# EAGLE design M502-3 (EAGLE 4.11)
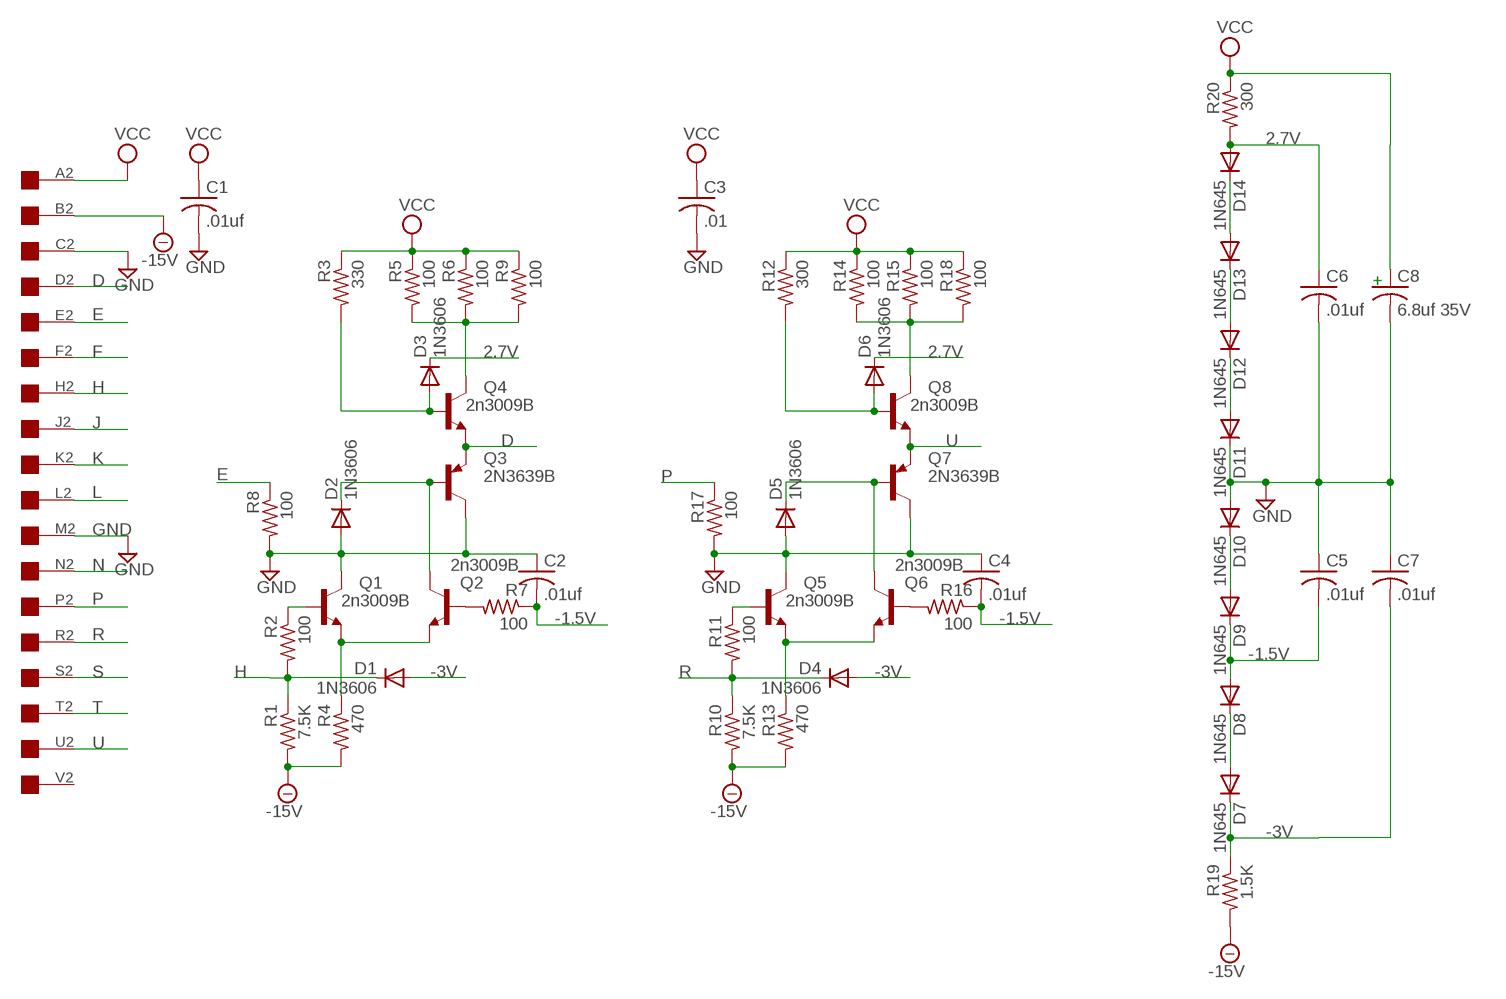
[diagram p0: schematic, sheet 1]

## Parts
A  ONE-SIDED  [ONE-SIDED]
C1  .01uf  C-US050-025X075  [C050-025X075]
C2  .01uf  C-US050-025X075  [C050-025X075]
C3  .01  C-US050-025X075  [C050-025X075]
C4  .01uf  C-US050-025X075  [C050-025X075]
C5  .01uf  C-US050-025X075  [C050-025X075]
C6  .01uf  C-US050-025X075  [C050-025X075]
C7  .01uf  C-US050-025X075  [C050-025X075]
C8  6.8uf 35V  C-US102-043X133  [C102-043X133]
D1  1N3606  1N4004  [DO41-10]
D2  1N3606  1N4004  [DO41-10]
D3  1N3606  1N4004  [DO41-10]
D4  1N3606  1N4004  [DO41-10]
D5  1N3606  1N4004  [DO41-10]
D6  1N3606  1N4004  [DO41-10]
D7  1N645  1N4004  [DO41-10]
D8  1N645  1N4004  [DO41-10]
D9  1N645  1N4004  [DO41-10]
D10  1N645  1N4004  [DO41-10]
D11  1N645  1N4004  [DO41-10]
D12  1N645  1N4004  [DO41-10]
D13  1N645  1N4004  [DO41-10]
D14  1N645  1N4004  [DO41-10]
Q1  2n3009B  2N1711  [TO39]
Q2  2n3009B  2N1711  [TO39]
Q3  2N3639B  2N5415  [TO39]
Q4  2n3009B  2N1711  [TO39]
Q5  2n3009B  2N1711  [TO39]
Q6  2n3009B  2N1711  [TO39]
Q7  2N3639B  2N5415  [TO39]
Q8  2n3009B  2N1711  [TO39]
R1  7.5K  R-US_0207/10  [0207/10]
R2  100  R-US_0207/10  [0207/10]
R3  330  R-US_0207/10  [0207/10]
R4  470  R-US_0207/10  [0207/10]
R5  100  R-US_0207/10  [0207/10]
R6  100  R-US_0207/10  [0207/10]
R7  100  R-US_0207/10  [0207/10]
R8  100  R-US_0207/10  [0207/10]
R9  100  R-US_0207/10  [0207/10]
R10  7.5K  R-US_0207/10  [0207/10]
R11  100  R-US_0207/10  [0207/10]
R12  300  R-US_0207/10  [0207/10]
R13  470  R-US_0207/10  [0207/10]
R14  100  R-US_0207/10  [0207/10]
R15  100  R-US_0207/10  [0207/10]
R16  100  R-US_0207/10  [0207/10]
R17  100  R-US_0207/10  [0207/10]
R18  100  R-US_0207/10  [0207/10]
R19  1.5K  R-US_0207/10  [0207/10]
R20  300  R-US_0207/10  [0207/10]

## Nets
2.7V: C6.1 D3.C D6.C D14.A R20.2
-1.5V: C2.2 C4.2 C5.2 D8.A D9.C R7.1 R16.1
-3V: C7.2 D1.A D4.A D7.C R19.1
-15V: A.B2 R1.2 R4.2 R10.2 R13.2 R19.2
D: A.D2 Q3.1(E) Q4.1(E)
E: A.E2 R8.1
F: A.F2
GND: A.C2 A.M2 C1.2 C2.1 C3.2 C4.1 C5.1 C6.2 C7.1 C8.2 D2.A D5.A D10.A D11.C Q1.3(C) Q3.3(C) Q5.3(C) Q7.3(C) R8.2 R17.2
H: A.H2 D1.C R1.1 R2.2
J: A.J2
K: A.K2
L: A.L2
N: A.N2
N$1: Q4.3(C) R5.2 R6.2 R9.2
N$2: Q1.2(B) R2.1
N$3: Q5.1(E) Q6.1(E) R13.1
N$4: Q1.1(E) Q2.1(E) R4.1
N$6: D11.A D12.C
N$7: D2.C Q2.3(C) Q3.2(B)
N$8: D3.A Q4.2(B) R3.2
N$9: D7.A D8.C
N$10: Q5.2(B) R11.1
N$11: D5.C Q6.3(C) Q7.2(B)
N$12: Q2.2(B) R7.2
N$13: D12.A D13.C
N$14: D9.A D10.C
N$15: Q8.3(C) R14.2 R15.2 R18.2
N$17: D13.A D14.C
N$18: D6.A Q8.2(B) R12.2
N$19: Q6.2(B) R16.2
P: A.P2 R17.1
R: A.R2 D4.C R10.1 R11.2
S: A.S2
T: A.T2
U: A.U2 Q7.1(E) Q8.1(E)
VCC: A.A2 C1.1 C3.1 C8.1 R3.1 R5.1 R6.1 R9.1 R12.1 R14.1 R15.1 R18.1 R20.1
Unconnected: A.V2

## Notes on the sheet
- +

## Library data of the parts
A = con-dec:ONE-SIDED: One-sided DEC Flip-Chip single card fingers
C1-C8 = rcl:C-US: CAPACITOR, American symbol
D1-D14 = diode:1N4004: DIODE general purpose rectifier, 1 A
Q1 Q2 Q4-Q6 Q8 = transistor-npn:2N1711: NPN Transistor
Q3 Q7 = transistor-pnp:2N5415*: PNP Transistror
R1-R20 = rcl:R-US_: RESISTOR, American symbol

## Board
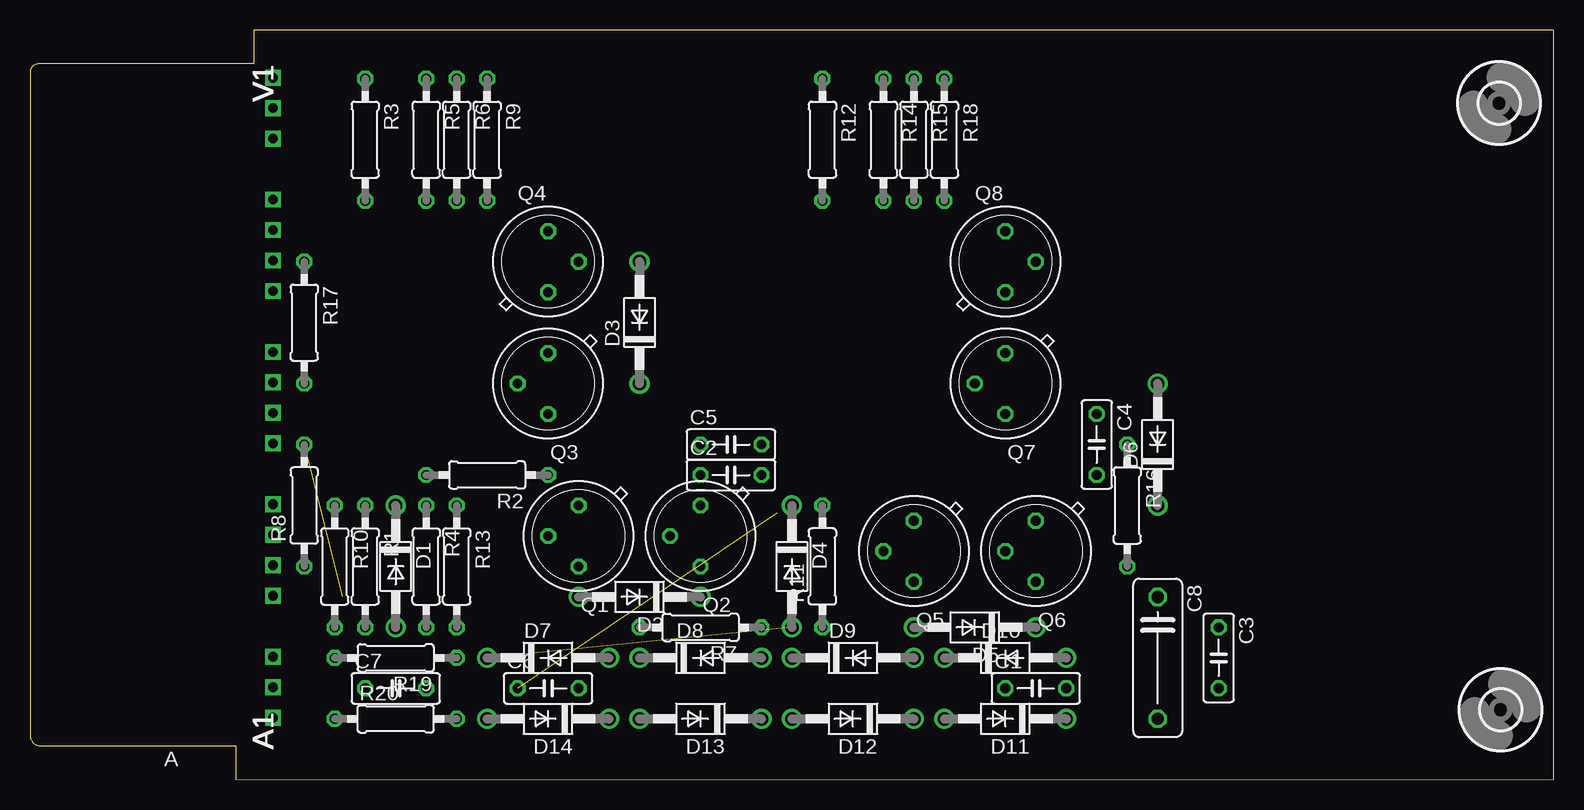
[diagram p1: board, top side]
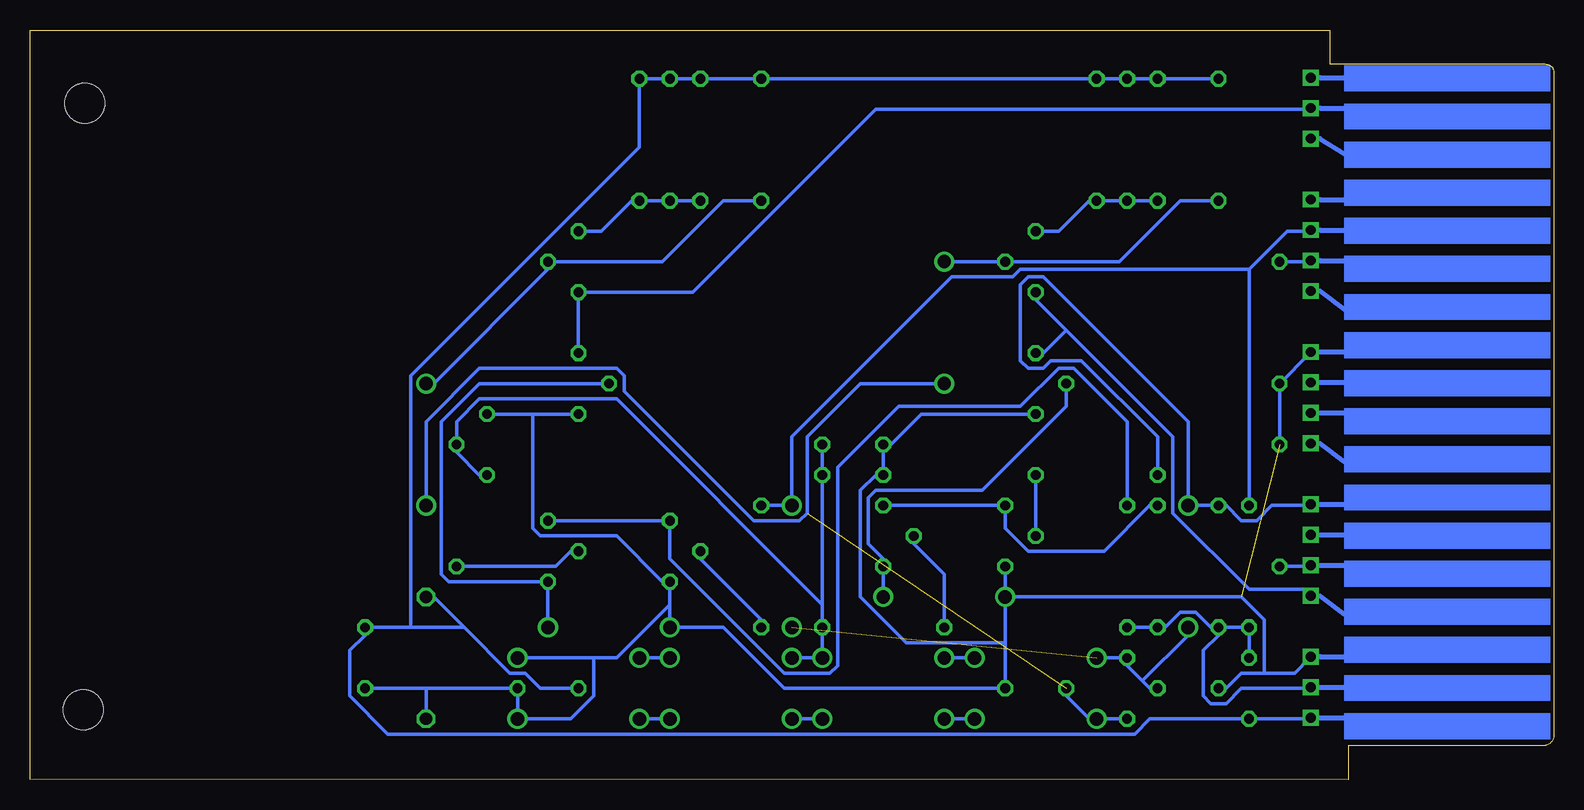
[diagram p2: board, bottom side, seen from below]

Size 126.98 x 62.48 mm. Coordinates in mm from the lower left corner, seen from the top.
Outline: 17.14,2.83 17.14,0 126.98,0.04 126.98,62.45 18.66,62.48 18.66,59.65 0.69,59.65 arc90 0,58.96 0,3.72 arc90 0.89,2.83 17.14,2.83
Copper layers (1*16): Top 0.035mm / dielectric 1.5mm / Bottom 0.035mm
Design rules "10mils": minimum track width 12mil, minimum drill 28mil, track to track 10mil, track to pad 10mil, pad to pad 10mil, via to via 10mil, smd to smd 10mil, copper to edge 40mil, drill to drill 10mil, minimum pad ring 10mil, minimum via ring 8mil, stop-mask expansion 0mil, vias tented up to drill 0mil, thermal gap 10mil

### Footprints (pad centres in the part's own frame; a part is rotated, then mirrored left to right if it is on the bottom)
ONE-SIDED = drill 0.813 square: A2 20.256,5.175; B2 20.256,7.715; C2 20.256,10.255; D2 20.256,15.335; E2 20.256,17.875; F2 20.256,20.415; H2 20.256,22.955; J2 20.256,28.035; K2 20.256,30.575; L2 20.256,33.115; M2 20.256,35.655; N2 20.256,40.735; P2 20.256,43.275; R2 20.256,45.815; S2 20.256,48.355; T2 20.256,53.435; U2 20.256,55.975; V2 20.256,58.515
C050-025X075 = drill 0.813 octagon: 1 -2.54,0; 2 2.54,0
C102-043X133 = drill 1.016 octagon: 1 -5.08,0; 2 5.08,0
DO41-10 = drill 1.118 round: A 5.08,0; C -5.08,0
TO39 = drill 0.813 octagon: 1 0,-2.54; 2 2.54,0; 3 0,2.54
0207/10 = drill 0.813 octagon: 1 -5.08,0; 2 5.08,0
3,3 = hole 3.3: 0,0

### Placement (x,y rotation side)
A  -0.01,0 0 top
C1  83.81,7.62 0 top
C2  58.41,25.4 0 top
C3  99.06,10.16 270 top
C4  88.9,27.94 270 top
C5  58.41,27.94 0 top
C6  43.17,7.62 0 top
C7  30.48,7.62 0 top
C8  93.98,10.16 270 top
D1  30.48,17.78 270 top
D2  50.79,15.24 180 top
D3  50.79,38.1 90 top
D4  63.49,17.78 270 top
D5  78.73,12.7 180 top
D6  93.98,27.94 90 top
D7  43.17,10.16 0 top
D8  55.88,10.16 0 top
D9  68.58,10.16 0 top
D10  81.28,10.16 0 top
D11  81.28,5.08 180 top
D12  68.58,5.08 180 top
D13  55.88,5.08 180 top
D14  43.17,5.08 180 top
Q1  45.71,20.32 180 top
Q2  55.88,20.32 180 top
Q3  43.17,33.02 180 top
Q4  43.17,43.18 0 top
Q5  73.66,19.05 180 top
Q6  83.81,19.05 180 top
Q7  81.28,33.02 180 top
Q8  81.28,43.18 0 top
R1  27.94,17.78 270 top
R2  38.09,25.4 180 top
R3  27.94,53.34 270 top
R4  33.02,17.78 270 top
R5  33.02,53.34 270 top
R6  35.55,53.34 270 top
R7  55.88,12.7 180 top
R8  22.86,22.86 90 top
R9  38.09,53.34 270 top
R10  25.39,17.78 270 top
R11  66.04,17.78 90 top
R12  66.04,53.34 270 top
R13  35.55,17.78 270 top
R14  71.12,53.34 270 top
R15  73.66,53.34 270 top
R16  91.44,22.86 270 top
R17  22.86,38.1 270 top
R18  76.2,53.34 270 top
R19  30.48,10.16 180 top
R20  30.48,5.08 0 top
U$2  [3,3]  122.42,56.39 0 top
U$3  [3,3]  122.55,5.84 0 top

### Tracks (layer width: path | path; a pad name or v marks a point on that pad's centre or on a via)
2.7V  (1 unrouted)
  Bottom 0.305: R20.2 36.19,5.08 37.46,5.08 D14.A 38.73,5.08 40.63,6.99 C6.1 | D3.C 51.43,33.02 57.78,33.02 62.22,28.57 62.22,22.23 62.86,21.59 66.67,21.59 77.47,32.38 77.47,33.66 78.1,34.29 89.53,34.29 93.98,29.84 93.98,23.5 D6.C
-1.5V
  Bottom 0.305: C4.2 89.53,25.4 91.44,27.3 R16.1 91.44,28.57 91.44,29.84 89.53,31.75 78.1,31.75 60.95,14.61 | C5.2 60.95,27.3 60.95,26.04 C2.2 60.95,24.77 60.95,14.61 | D9.C 62.86,10.16 61.59,10.16 D8.A 60.95,10.79 60.95,12.06 R7.1 60.95,13.34 60.95,14.61
-3V  (1 unrouted)
  Bottom 0.305: 34.28,8.26 35.55,9.53 R19.1 36.19,10.16 37.46,10.16 D7.C | 34.28,8.26 33.65,7.62 C7.2 | 34.28,8.26 30.48,12.06 D1.A
-15V
  Bottom 0.305: R13.2 34.92,12.7 33.65,12.7 R4.2 32.38,12.7 31.11,13.97 29.84,13.97 28.57,12.7 R1.2 | R19.2 25.39,10.79 25.39,12.06 R10.2 26.03,12.7 27.3,12.7 R1.2 | A.B2 20.32,7.62 26.03,7.62 27.3,6.35 28.57,6.35 29.21,6.99 29.21,10.79 27.94,12.06 R1.2
D
  Bottom 0.305: 40.63,37.47 43.17,40.01 Q4.1 | 40.63,37.47 31.75,28.57 31.75,22.23 25.39,15.88 20.32,15.88 A.D2 | 40.63,37.47 42.54,35.56 Q3.1
E
  Bottom 0.305: R8.1 22.22,17.78 20.32,17.78 A.E2
GND  (1 unrouted)
  Bottom 0.305: 93.98,7.62 86.99,7.62 C1.2 86.36,6.99 86.36,5.71 D11.C 85.72,5.08 81.91,5.08 80.01,6.99 80.01,10.16 | 93.98,7.62 98.42,7.62 C3.2 | 93.98,7.62 93.98,5.71 C8.2 | 85.09,30.48 88.26,30.48 C4.1 | 85.09,30.48 81.91,30.48 Q7.3 | 73.66,14.61 73.66,13.34 D5.A 73.02,12.7 69.21,12.7 64.13,7.62 46.35,7.62 C6.2 45.71,8.26 45.71,11.43 | 73.66,14.61 73.66,15.88 Q5.3 74.29,16.51 78.1,20.32 84.45,20.32 85.09,20.95 85.09,30.48 | 80.01,10.16 78.1,10.16 73.66,14.61 | 80.01,10.16 85.72,10.16 D10.A | Q3.3 43.81,30.48 52.7,30.48 55.24,27.94 C5.1 55.88,27.3 55.88,26.04 C2.1 56.51,25.4 57.78,24.13 57.78,15.24 53.97,11.43 45.71,11.43 | 24.12,8.89 21.59,8.89 20.32,10.16 A.C2 | 24.12,8.89 26.03,8.89 27.3,7.62 C7.1 | 45.71,11.43 45.71,14.61 D2.A | Q1.3 45.71,17.14 45.71,15.88 D2.A | 24.12,8.89 24.12,13.34 26.03,15.24 45.08,15.24 D2.A | R8.2 22.86,28.57 22.86,32.38 R17.2 20.32,35.56 A.M2
H
  Bottom 0.305: A.H2 20.32,22.86 23.49,22.86 24.76,21.59 26.03,21.59 27.3,22.86 R1.1 28.57,22.86 29.84,22.86 D1.C 30.48,23.5 30.48,29.84 42.54,41.91 43.81,41.91 44.45,41.27 44.45,34.92 43.81,34.29 42.54,34.29 41.9,34.92 39.36,34.92 33.02,28.57 33.02,26.04 R2.2
N$1
  Bottom 0.305: R5.2 33.65,48.26 34.92,48.26 R6.2 36.19,48.26 37.46,48.26 R9.2 38.73,48.26 41.27,45.72 42.54,45.72 Q4.3
N$2
  Bottom 0.305: Q1.2 43.17,20.95 43.17,24.77 R2.1
N$3
  Bottom 0.305: R13.1 35.55,23.5 35.55,29.84 40,34.29 41.27,34.29 44.45,31.11 54.6,31.11 59.68,26.04 59.68,9.53 60.32,8.89 64.13,8.89 73.66,18.41 73.66,20.95 Q5.1 74.29,21.59 83.18,21.59 Q6.1
N$4
  Bottom 0.305: R4.1 33.65,22.86 37.46,19.05 43.81,19.05 45.71,20.95 45.71,22.23 Q1.1 46.35,22.86 55.24,22.86 Q2.1
N$6
  Bottom 0.305: D12.C 74.29,5.08 75.56,5.08 D11.A
N$7
  Bottom 0.305: Q3.2 40.63,32.38 40.63,31.11 47.62,24.13 56.51,24.13 57.14,23.5 57.14,19.68 55.88,18.41 Q2.3 55.88,17.14 55.88,15.88 D2.C
N$8
  Bottom 0.305: R3.2 28.57,48.26 31.11,48.26 36.19,43.18 45.08,43.18 Q4.2 46.35,43.18 50.16,43.18 D3.A
N$9
  Bottom 0.305: D7.A 48.89,10.16 50.16,10.16 D8.C
N$10
  Bottom 0.305: R11.1 66.04,13.34 71.12,18.41 Q5.2
N$11
  Bottom 0.305: D5.C 83.81,13.34 83.81,15.88 Q6.3 84.45,16.51 92.07,16.51 92.7,17.14 92.7,29.84 89.53,33.02 79.37,33.02 Q7.2
N$12
  Bottom 0.305: R7.2 50.79,13.34 50.79,17.14 53.34,19.68 Q2.2
N$13
  Bottom 0.305: D13.C 61.59,5.08 62.86,5.08 D12.A
N$14
  Bottom 0.305: D9.A 74.29,10.16 75.56,10.16 D10.C
N$15
  Bottom 0.305: R14.2 71.75,48.26 73.02,48.26 R15.2 74.29,48.26 75.56,48.26 R18.2 76.83,48.26 79.37,45.72 80.64,45.72 Q8.3
N$17
  Bottom 0.305: D14.C 48.89,5.08 50.16,5.08 D13.A
N$18
  Bottom 0.305: R12.2 66.67,48.26 69.21,48.26 74.29,43.18 83.18,43.18 Q8.2 83.81,42.55 93.34,33.02 D6.A
N$19
  Bottom 0.305: R16.2 90.8,17.78 83.18,17.78 81.91,19.05 Q6.2
P
  Bottom 0.305: A.P2 20.32,43.18 22.22,43.18 R17.1
R
  Bottom 0.305: R11.2 65.4,22.86 64.13,22.86 D4.C 63.49,23.5 63.49,28.57 50.16,41.91 45.08,41.91 44.45,42.55 25.39,42.55 | 25.39,42.55 22.22,45.72 20.32,45.72 A.R2 | 25.39,42.55 25.39,23.5 R10.1
U
  Bottom 0.305: Q7.1 81.28,36.2 81.28,40.01 Q8.1 80.64,40.64 71.75,40.64 56.51,55.88 20.32,55.88 A.U2
VCC
  Bottom 0.305: R3.1 28.57,58.42 32.38,58.42 R5.1 33.65,58.42 34.92,58.42 R6.1 36.19,58.42 37.46,58.42 R9.1 38.73,58.42 65.4,58.42 R12.1 66.67,58.42 70.48,58.42 R14.1 71.75,58.42 73.02,58.42 R15.1 74.29,58.42 75.56,58.42 R18.1 76.2,57.78 76.2,52.7 95.25,33.66 95.25,12.7 | A.A2 20.32,5.08 24.76,5.08 R20.1 26.03,5.08 33.65,5.08 34.92,3.81 97.15,3.81 100.33,6.99 100.33,10.79 99.06,12.06 C3.1 98.42,12.7 95.25,12.7 | 90.8,12.7 93.34,15.24 C8.1 | 90.8,12.7 86.99,8.89 85.72,8.89 84.45,7.62 81.91,7.62 C1.1 | 95.25,12.7 90.8,12.7

### Text on the board
tNames: V1 | V1 | V1 | V1 | V1 | V1 | V1 | V1 | V1 | V1 | V1 | V1 | V1 | V1 | V1 | V1 | V1 | V1 | V1 | V1 | V1 | V1 | V1 | V1 | V1 | V1 | V1 | V1 | V1 | V1 | V1 | V1 | A1 | A1 | A1 | A1 | A1 | A1 | A1 | A1 | A1 | A1 | A1 | A1 | A1 | A1 | A1 | A1 | A1 | A1 | A1 | A1 | A1 | A1 | A1 | A1 | A1 | A1 | A1 | A1 | A1 | A1 | A1 | A1